# EAGLE schematic Photoresistor schem (EAGLE 9.5.2)
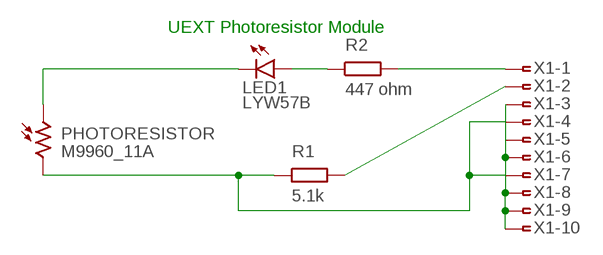
[diagram p0: schematic, sheet 1]

## Parts
LED1  LYW57B  [W57B]
PHOTORESISTOR  M9960_11A  [M9960]
R1  5.1k  R  (no package)
R2  447 ohm  R  (no package)
X1  FSIDE-10  [FSIDE-10]

## Nets
N$1: R1.2 X1.2
N$2: PHOTORESISTOR.2 R1.1 X1.4 X1.7
N$3: LED1.C LED1.C@1(C) LED1.C@2(C) LED1.C@3(C) LED1.C@4(C) LED1.C@5(C) PHOTORESISTOR.1
N$4: R2.2 X1.1
N$5: X1.3 X1.5 X1.6 X1.8 X1.9 X1.10
N$6: LED1.A R2.1

## Notes on the sheet
- UEXT Photoresistor Module

## Library data of the parts
LED1 = led:*W57B: Golden Dragon® 1 Watt LED Place heat sink pads of cathode with INVOKE Source: www.osram-os.com la_ly_w57b.pdf
PHOTORESISTOR = photo-elements:M9960_11: Photo Sensor Beacon Light, Photometer Applications Source: http://optoelectronics.perkinelmer.com/content/Datasheets/DTS_M9960.pdf
R1 R2 = ngspice-simulation:R: RESISTOR
X1 = con-amp:FSIDE-10: AMP connector